# Altium schematic sheet 12.SchDoc
size 420 x 297 mm
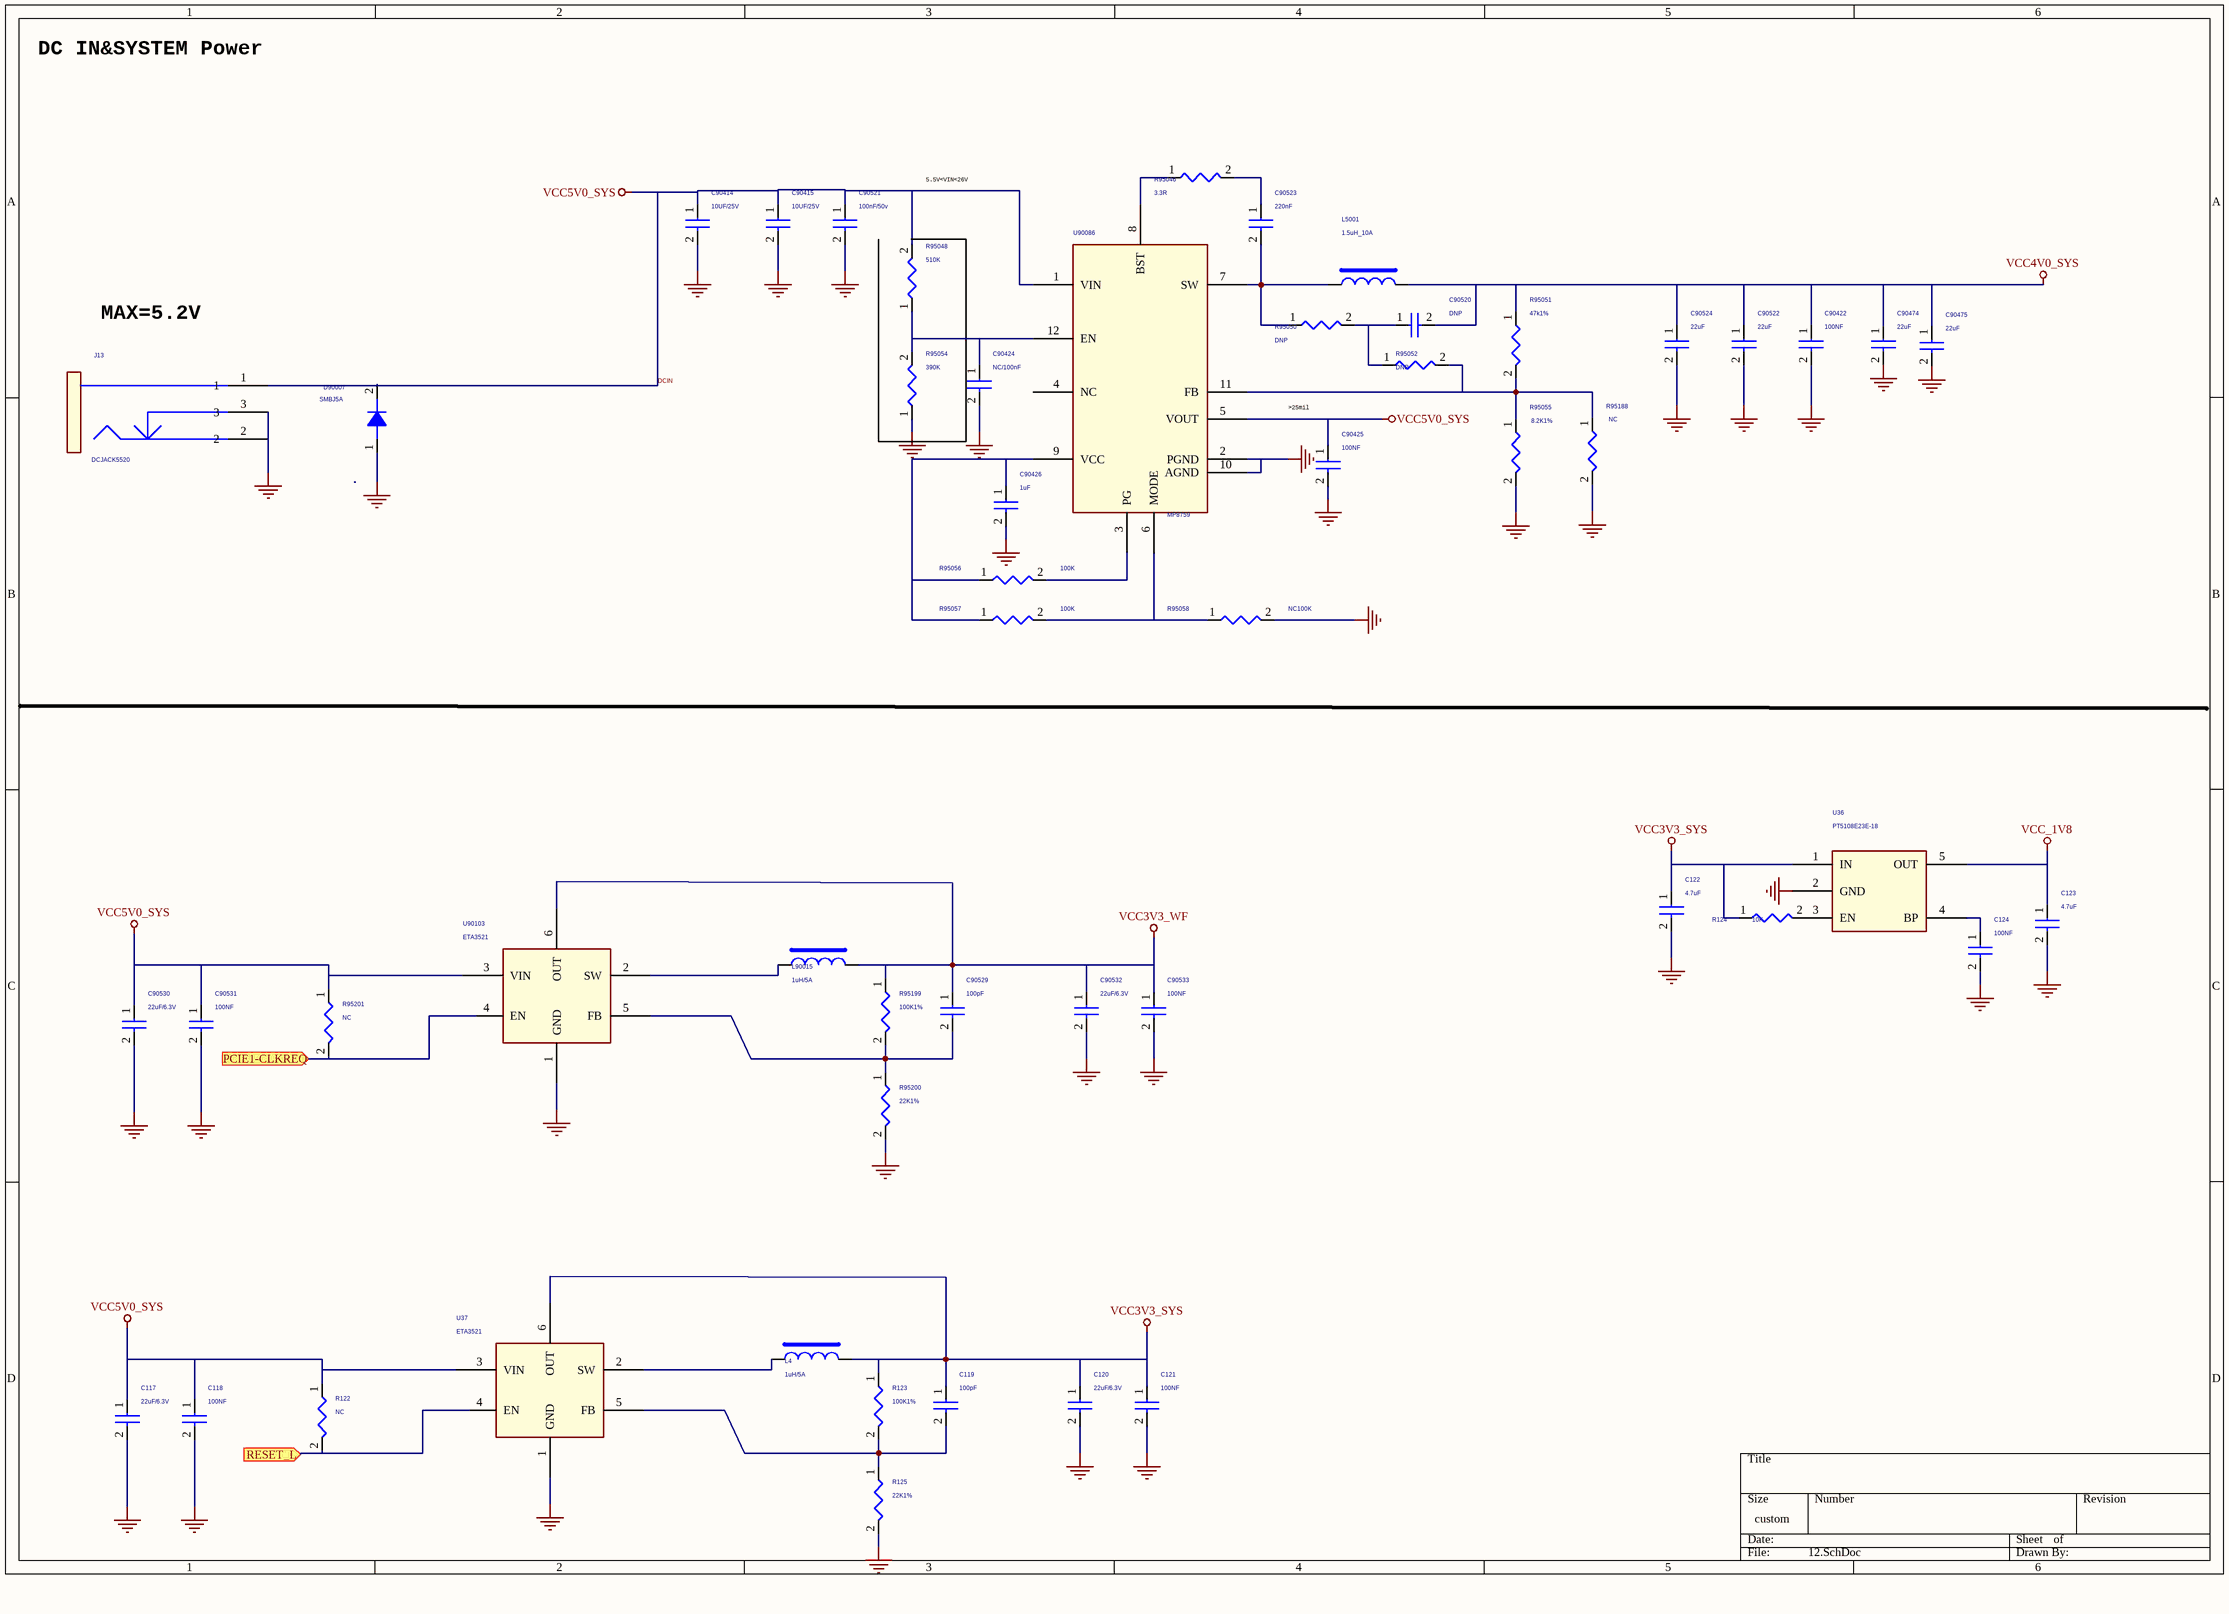
[diagram p0: 12.SchDoc]

## Parts
C117  22uF/6.3V  [C0805]
C118  100NF  [C0402]
C119  100pF  [C0402]
C120  22uF/6.3V  [C0805]
C121  100NF  [C0402]
C122  4.7uF  [c0402]
C123  4.7uF  [c0402]
C124  100NF  [C0402]
C90414  10UF/25V  [C1206]
C90415  10UF/25V  [C1206]
C90422  100NF  [C0402]
C90424  NC/100nF  [C0402]
C90425  100NF  [c0201]
C90426  1uF  [c0201]
C90474  22uF  [C0805]
C90475  22uF  [C0805]
C90520  DNP  [C0402]
C90521  100nF/50v  [C0603]
C90522  22uF  [C0805]
C90523  220nF  [C0402]
C90524  22uF  [C0805]
C90529  100pF  [C0402]
C90530  22uF/6.3V  [C0805]
C90531  100NF  [C0402]
C90532  22uF/6.3V  [C0805]
C90533  100NF  [C0402]
D90007  SMBJ5A  [DO214AA]
J13  DCJACK5520  [DCJACK5520]
L4  1uH/5A  [IND-303015]
L5001  1.5uH_10A  [IND_606045]
L90015  1uH/5A  [IND-303015]
R122  NC  [R0402]
R123  100K1%  [R0402]
R124  10K  [R0402]
R125  22K1%  [R0402]
R95046  3.3R  [R0402]
R95048  510K  [R0402]
R95050  DNP  [R0402]
R95051  47k1%  [R0402]
R95052  DNP  [R0402]
R95054  390K  [R0402]
R95055  8.2K1%  [R0402]
R95056  100K  [R0402]
R95057  100K  [R0402]
R95058  NC100K  [R0402]
R95188  NC  [R0402]
R95199  100K1%  [R0402]
R95200  22K1%  [R0402]
R95201  NC  [R0402]
U36  PT5108E23E-18  [SOT_23_5]
U37  ETA3521  [SOT563]
U90086  MP8759  [QFN12_2R00X3R00X1R00]
U90103  ETA3521  [SOT563]

## Ports
PCIE1-CLKREQ (in), RESET_L (in)

## Nets
DCIN: C117.1 C118.1 C90414.1 C90415.1 C90425.1 C90521.1 C90530.1 C90531.1 D90007.2(K) J13.1 R122.1 R95048.2 R95201.1 U37.3(VIN) U90086.1(VIN) U90086.5(VOUT) U90103.3(VIN)  [also labelled VCC5V0_SYS]
GND: C117.2 C118.2 C120.2 C121.2 C122.2 C123.2 C124.2 C90414.2 C90415.2 C90422.2 C90424.2 C90425.2 C90426.2 C90474.2 C90475.2 C90521.2 C90522.2 C90524.2 C90530.2 C90531.2 C90532.2 C90533.2 D90007.1(A) J13.2 J13.3 R125.2 R95054.1 R95055.2 R95058.2 R95188.2 R95200.2 U36.2(GND) U37.1(GND) U90086.2(PGND) U90086.10(AGND) U90103.1(GND)
VCC3V3_SYS: C119.1 C120.1 C121.1 C122.1 L4.2 R123.1 R124.1 U36.1(IN) U37.6(OUT)
VCC3V3_WF: C90529.1 C90532.1 C90533.1 L90015.2 R95199.1 U90103.6(OUT)
VCC4V0_SYS: C90422.1 C90474.1 C90475.1 C90520.2 C90522.1 C90524.1 L5001.2 R95051.1
VCC_1V8: C123.1 U36.5(OUT)
PCIE1-CLKREQ: R95201.2 U90103.4(EN) ; port PCIE1-CLKREQ
RESET_L: R122.2 U37.4(EN) ; port RESET_L
NetC119_2: C119.2 R123.2 R125.1 U37.5(FB)
NetC124_1: C124.1 U36.4(BP)
NetC90424_1: C90424.1 R95048.1 R95054.2 U90086.12(EN)
NetC90426_1: C90426.1 R95056.1 R95057.1 U90086.9(VCC)
NetC90520_1: C90520.1 R95050.2 R95052.1
NetC90523_1: C90523.1 R95046.2
NetC90523_2: C90523.2 L5001.1 R95050.1 U90086.7(SW)
NetC90529_2: C90529.2 R95199.2 R95200.1 U90103.5(FB)
NetL4_1: L4.1 U37.2(SW)
NetL90015_1: L90015.1 U90103.2(SW)
NetR124_2: R124.2 U36.3(EN)
NetR95046_1: R95046.1 U90086.8(BST)
NetR95051_2: R95051.2 R95052.2 R95055.1 R95188.1 U90086.11(FB)
NetR95056_2: R95056.2 U90086.3(PG)
NetR95057_2: R95057.2 R95058.1 U90086.6(MODE)

Not connected (* = marked no-connect by the designer): U90086 4(NC)

## Notes on the sheet
- DC IN&SYSTEM Power
- 5.5V<VIN<26V
- MAX=5.2V
- >25mil

## Library data of the parts
C117 C90530 = CAP NP: cap,10.00uF,+/-10%,25V,X5R,C0805; Manufacturer PN: C2012X5R1E106K085AC; Manufacturer: TDK; Tolerance: 10%; Priority: A; Voltage: 25V; Dielectric: X5R; Created by: JJJ; Part Type: C0805; RK PN: C2012X5R1E106K085AC
C118 = CAP NP: cap,100.00nF,+/-10%,25V,X5R,C0402; Manufacturer: TDK; RK PN: C1005X5R1E104K050BC; Priority: A; Tolerance: 10%; Voltage: 25V; Dielectric: X5R; Part Type: C0402; Manufacturer PN: C1005X5R1E104K050BC; Created by: JJJ
C119 C90529 = CAP NP: cap,100.00pF,+/-5%,50V,C0G,C0402; Manufacturer PN: C1005C0G1H101J050BA; Manufacturer: TDK; Tolerance: 5%; Priority: A; Voltage: 50V; Dielectric: C0G; Created by: JJJ; Part Type: C0402; RK PN: C1005C0G1H101J050BA
C120 C90532 = CAP NP: cap,10.00uF,+/-10%,10V,X5R,C0805; Manufacturer PN: C2012X5R1A106K125AB; Manufacturer: TDK; Tolerance: 10%; Priority: A; Voltage: 10V; Dielectric: X5R; Created by: JJJ; Part Type: C0805; RK PN: C2012X5R1A106K125AB
C121 C90533 = CAP NP: cap,100.00nF,+/-10%,10V,X5R,C0402; Manufacturer: TDK; RK PN: C1005X5R1A104K050BA; Priority: A; Tolerance: 10%; Voltage: 10V; Dielectric: X5R; Part Type: C0402; Manufacturer PN: C1005X5R1A104K050BA; Created by: JJJ
C122 = CAP NP: cap,4.70uF,+/-10%,10V,X5R,C0603; Manufacturer PN: C1608X5R1A475K080AC; Manufacturer: TDK; Tolerance: 10%; Priority: A; Voltage: 10V; Dielectric: X5R; Created by: JJJ; Part Type: C0603; RK PN: C1608X5R1A475K080AC
C123 = CAP NP: cap,4.70uF,+/-10%,10V,X5R,C0603; Manufacturer: TDK; RK PN: C1608X5R1A475K080AC; Priority: A; Tolerance: 10%; Voltage: 10V; Dielectric: X5R; Part Type: C0603; Manufacturer PN: C1608X5R1A475K080AC; Created by: JJJ
C124 = CAP NP: cap,100.00nF,+/-10%,16V,X5R,C0402; Manufacturer: TDK; RK PN: C1005X5R1C104K050BA; Priority: A; Tolerance: 10%; Voltage: 16V; Dielectric: X5R; Part Type: C0402; Manufacturer PN: C1005X5R1C104K050BA; Created by: JJJ
C90414 = CAP NP: cap,10.00uF,+/-10%,25V,X5R,C1206; Manufacturer PN: C3216X5R1E106K085AC; Manufacturer: TDK; Tolerance: 10%; C_Voltage: 6.3V; Priority: A; Voltage: 25V; Dielectric: X5R; Created by: JJJ; Part Type: C1206; RK PN: C3216X5R1E106K085AC
C90415 = CAP NP: cap,10.00uF,+/-10%,25V,X5R,C1206; Manufacturer: TDK; RK PN: C3216X5R1E106K085AC; Priority: A; C_Voltage: 6.3V; Tolerance: 10%; Voltage: 25V; Dielectric: X5R; Part Type: C1206; Manufacturer PN: C3216X5R1E106K085AC; Created by: JJJ
C90422 C90425 = CAP NP: cap,100.00nF,+/-10%,10V,X5R,C0402; Manufacturer: TDK; Number: 37; RK PN: C1005X5R1A104K050BA; Priority: A; Tolerance: 10%; C_Voltage: 6.3V; Voltage: 10V; Dielectric: X5R; Part Type: C0402; Manufacturer PN: C1005X5R1A104K050BA; Created by: JJJ
C90424 = CAP NP: cap,100.00nF,+/-10%,25V,X5R,C0402; Manufacturer PN: C1005X5R1E104K050BC; Manufacturer: TDK; C_Voltage: 6.3V; Tolerance: 10%; Priority: A; Number: 37; Option: DNP; Voltage: 25V; Dielectric: X5R; Created by: JJJ; Part Type: C0402; RK PN: C1005X5R1E104K050BC
C90426 = CAP NP: cap,1.00uF,+/-10%,10V,X5R,C0402; Manufacturer: TDK; Number: 37; RK PN: C1005X5R1A105K050BB; Priority: A; Tolerance: 10%; C_Voltage: 6.3V; Voltage: 10V; Dielectric: X5R; Part Type: C0402; Manufacturer PN: C1005X5R1A105K050BB; Created by: JJJ
C90474 C90475 C90524 = CAP NP: cap,22.00uF,+/-10%,10V,X5R,C0805; Manufacturer PN: C2012X5R1A226K125AB; Manufacturer: TDK; Tolerance: 10%; C_Voltage: 6.3V; Priority: A; Voltage: 10V; Dielectric: X5R; Created by: JJJ; Part Type: C0805; RK PN: C2012X5R1A226K125AB
C90520 = CAP NP: Did Not Place.; Manufacturer PN: DNPC0402; C_Voltage: 6.3V; Priority: A; Number: 37; Created by: JJJ; Part Type: DNP; RK PN: DNPC0402
C90521 = CAP NP: cap,100.00nF,+/-10%,50V,X5R,C0603; Manufacturer PN: C1608X5R1H104K080AA; Manufacturer: TDK; Tolerance: 10%; Priority: A; Voltage: 50V; Dielectric: X5R; Created by: JJJ; Part Type: C0603; RK PN: C1608X5R1H104K080AA
C90522 = CAP NP: cap,22.00uF,+/-10%,10V,X5R,C0805; Manufacturer: TDK; RK PN: C2012X5R1A226K125AB; Priority: A; C_Voltage: 6.3V; Tolerance: 10%; Voltage: 10V; Dielectric: X5R; Part Type: C0805; Manufacturer PN: C2012X5R1A226K125AB; Created by: JJJ
C90523 = CAP NP: cap,220.00nF,+/-10%,25V,X5R,C0402; Manufacturer PN: C1005X5R1E224K050BC; Manufacturer: TDK; C_Voltage: 6.3V; Tolerance: 10%; Priority: A; Number: 37; Voltage: 25V; Dielectric: X5R; Created by: JJJ; Part Type: C0402; RK PN: C1005X5R1E224K050BC
C90531 = CAP NP: cap,100.00nF,+/-10%,25V,X5R,C0402; Manufacturer PN: C1005X5R1E104K050BC; Manufacturer: TDK; Tolerance: 10%; Priority: A; Voltage: 25V; Dielectric: X5R; Created by: JJJ; Part Type: C0402; RK PN: C1005X5R1E104K050BC
D90007 = DIODE_Dup2: Schottky Barrier，SS32 DO214AC; Manufacturer PN: SS32; Manufacturer: 星海; Priority: A; Created by: JJJ; Part Type: Schottky rectifier; RK PN: SS32
L4 L90015 = INDUCTORS OF FERRITE: Power Inductor,3.3uH,0.2,IND_404030; Manufacturer: sunlord; Isat: 3.3A; DC Resistor: 0.04ohm; RK PN: SWPA4030S3R3MT; Priority: A; Tolerance: 20%; Irms: 2.4A; Resonace frequency: 38M; Part Type: POWER_IND; Manufacturer PN: SWPA4030S3R3MT; Created by: YTL
L5001 = INDUCTORS OF FERRITE: Power Inductor,1.5uH,MWSA0603S-1R5MT; Manufacturer: Vishay; Isat: 9.6A; Priority: A; Tolerance: 20%; Irms: 10.5A; Option: >8A; Part Type: IND; Created by: JJJ
R122 R95054 R95057 R95201 = RESISTOR: 通用厚膜电阻,100K,+/-5%,R0402,1/16W.; Manufacturer PN: RC0402JR-07100KL; Manufacturer: YAGEO; Tolerance: 5%; Wattage: 1/16W; Priority: A; Created by: YTL; Part Type: 通用厚膜电阻; RK PN: RC0402JR-07100KL
R123 R95199 = RESISTOR: 通用厚膜电阻,75K,+/-1%,R0402,1/16W.; Manufacturer PN: RC0402FR-0775KL; Manufacturer: YAGEO; Tolerance: 1%; Wattage: 1/16W; Priority: A; Created by: YTL; Part Type: 通用厚膜电阻; RK PN: RC0402FR-0775KL
R124 = RESISTOR: 通用厚膜电阻,10K,+/-5%,R0402,1/16W.; Manufacturer: YAGEO; Tolerance: 5%; RK PN: RC0402JR-0710KL; Priority: A; Wattage: 1/16W; Part Type: 通用厚膜电阻; Manufacturer PN: RC0402JR-0710KL; Created by: YTL
R125 R95200 = RESISTOR: 通用厚膜电阻,10K,+/-1%,R0402,1/16W.; Manufacturer: YAGEO; Tolerance: 1%; RK PN: RC0402FR-0710KL; Priority: A; Wattage: 1/16W; Part Type: 通用厚膜电阻; Manufacturer PN: RC0402FR-0710KL; Created by: YTL
R95046 = RESISTOR: 通用厚膜电阻,3R3,+/-5%,R0402,1/16W.; Manufacturer PN: RC0402JR-073R3L; Manufacturer: YAGEO; Tolerance: 5%; Wattage: 1/16W; Priority: A; Created by: YTL; Part Type: 通用厚膜电阻; RK PN: RC0402JR-073R3L
R95048 = RESISTOR: 通用厚膜电阻,510K,+/-5%,R0402,1/16W.; Manufacturer PN: RC0402JR-07510KL; Manufacturer: YAGEO; Tolerance: 5%; Wattage: 1/16W; Priority: A; Created by: YTL; Part Type: 通用厚膜电阻; RK PN: RC0402JR-07510KL
R95050 R95052 = RESISTOR: Did Not Place.; RK PN: DNPR0402; Priority: A; Part Type: DNP; Manufacturer PN: DNPR0402; Created by: JJJ
R95051 = RESISTOR: 通用厚膜电阻,43K,+/-1%,R0402,1/16W.; Manufacturer: YAGEO; Tolerance: 1%; RK PN: RC0402FR-0743KL; Priority: A; Wattage: 1/16W; Part Type: 通用厚膜电阻; Manufacturer PN: RC0402FR-0743KL; Created by: YTL
R95055 R95188 = RESISTOR: 通用厚膜电阻,7K5,+/-1%,R0402,1/16W.; Manufacturer PN: RC0402FR-077K5L; Manufacturer: YAGEO; Tolerance: 1%; Wattage: 1/16W; Priority: A; Created by: YTL; Part Type: 通用厚膜电阻; RK PN: RC0402FR-077K5L
R95056 = RESISTOR: 通用厚膜电阻,100K,+/-5%,R0402,1/16W.; Manufacturer: YAGEO; Tolerance: 5%; RK PN: RC0402JR-07100KL; Priority: A; Wattage: 1/16W; Part Type: 通用厚膜电阻; Manufacturer PN: RC0402JR-07100KL; Created by: YTL
R95058 = RESISTOR: 通用厚膜电阻,100K,+/-5%,R0402,1/16W.; Manufacturer PN: RC0402JR-07100KL; Manufacturer: YAGEO; Tolerance: 5%; Wattage: 1/16W; Priority: A; Option: DNP; Created by: YTL; Part Type: 通用厚膜电阻; RK PN: RC0402JR-07100KL
U36 = LDO_PT5108: 1.8V Output,300mA, Low Dropout, Low Noise Ultra-Fast Without Bypass Capacitor CMOS LDO Regulator; Manufacturer PN: RT9193-18GB; Manufacturer: Richtek（立錡）; Priority: A; Created by: JJJ; Part Type: LDO; RK PN: RT9193-18GB
U90086 = MP8759_6